# Altium schematic sheet Sch_Dr_IMU .SchDoc
size A4 portrait; Organization: Altium Limited; Address1: L3, 12a Rodborough Rd; Address2: Frenchs Forest; Address3: NSW; Address4: Australia 2086
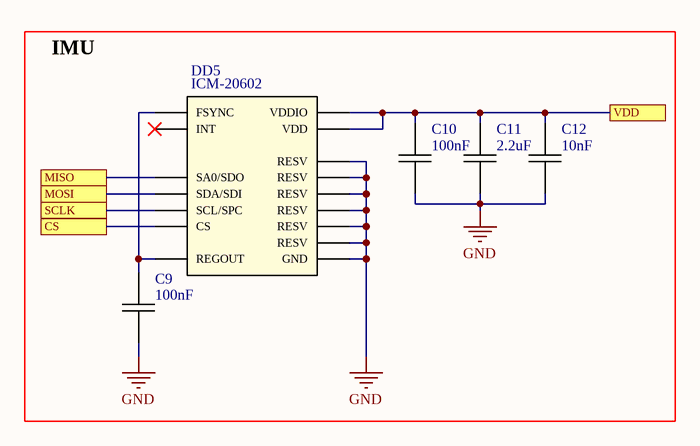
[diagram p0: Sch_Dr_IMU .SchDoc]

## Parts
C9  100nF  [Cap_0603]
C10  100nF  [Cap_0603]
C11  2.2uF  [Cap_0603]
C12  10nF  [Cap_0603]
DD5  ICM-20602  [16-pin LGA]

## Blocks framed on the sheet
IMU: C9-C12 DD5

## Ports
CS, MISO, MOSI, SCLK, VDD

## Nets
GND: C9.2 C10.2 C11.2 C12.2 DD5.7(RESV) DD5.9(RESV) DD5.10(RESV) DD5.11(RESV) DD5.12(RESV) DD5.13(GND) DD5.15(RESV)
CS: DD5.5(CS) ; port CS
MISO: DD5.4(SA0/SDO) ; port MISO
MOSI: DD5.3(SDA/SDI) ; port MOSI
SCLK: DD5.2(SCL/SPC) ; port SCLK
VDD: C10.1 C11.1 C12.1 DD5.1(VDDIO) DD5.16(VDD) ; port VDD
NetC9_1: C9.1 DD5.8(FSYNC) DD5.14(REGOUT)

Not connected (* = marked no-connect by the designer): DD5 6(INT)*

## Notes on the sheet
- Title
- Size:
- Date:
- A4
- Number:
- Time:
- Revision:
- Sheet
- of
- File:

## Library data of the parts
C9 C10 = Cap_: CC0603JRX7R8BB104
C11 = Cap_: CC0603KRX5R7BB225
C12 = Cap_: CC0603JRNPO9BN103
DD5 = ICM-20602: 6-axis MotionTracking device. / 3-axis gyroscope, 3-axis accelerometer